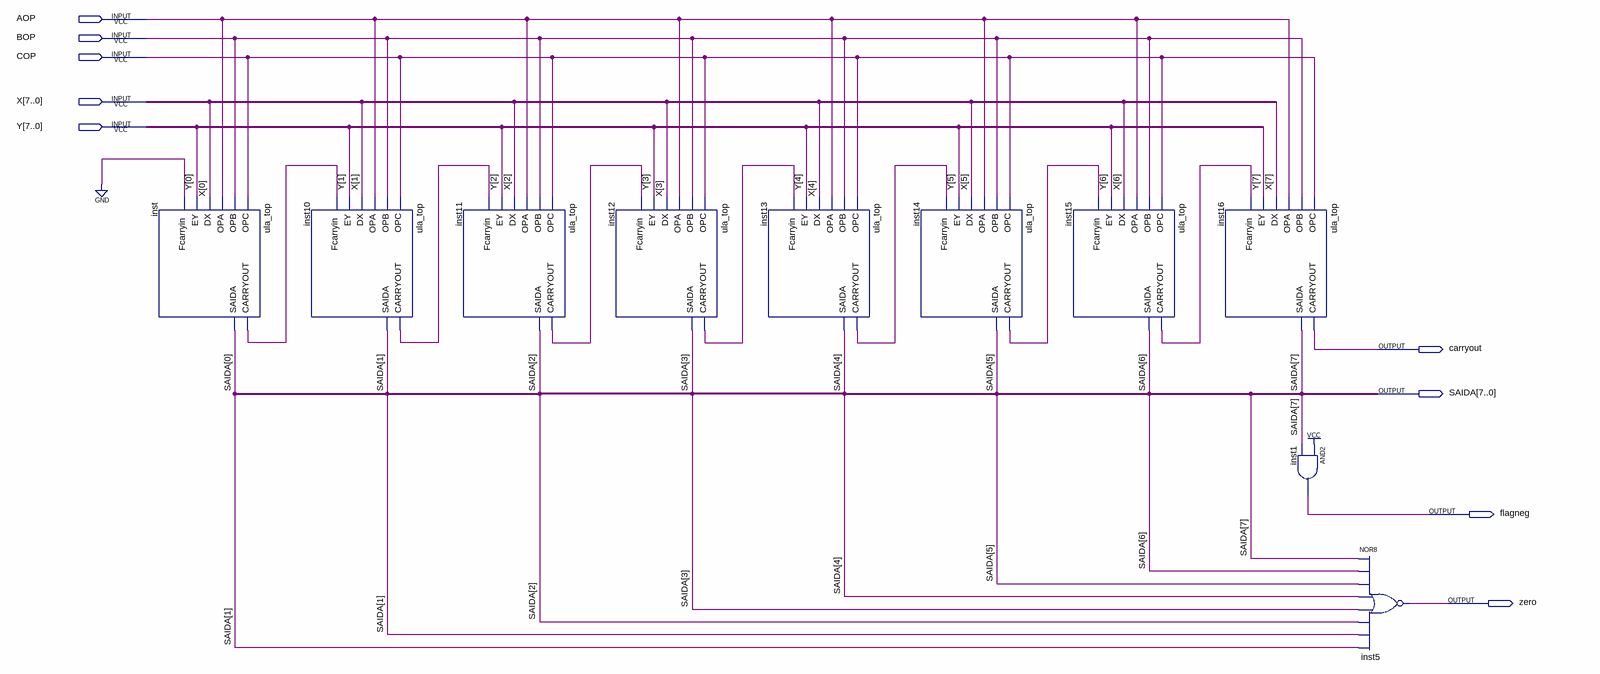
[diagram p0: schematic sheet]
// Quartus schematic ula16.bdf as structural Verilog: 10 symbols, 9 pins
module ula16 (
  input  AOP,
  input  BOP,
  input  COP,
  input  [7:0] X,
  input  [7:0] Y,
  output carryout,
  output [7:0] SAIDA,
  output flagneg,
  output zero
);

  wire inst10_carryout, inst11_carryout, inst12_carryout, inst13_carryout, inst14_carryout, inst15_carryout,
       inst_carryout;

  ula_top inst (
    .OPC(COP), .OPB(BOP), .OPA(AOP), .DX(X[0]), .EY(Y[0]), .Fcarryin(1'b0), .CARRYOUT(inst_carryout),
    .SAIDA(SAIDA[0]));
  ula_top inst10 (
    .OPC(COP), .OPB(BOP), .OPA(AOP), .DX(X[1]), .EY(Y[1]), .Fcarryin(inst_carryout),
    .CARRYOUT(inst10_carryout), .SAIDA(SAIDA[1]));
  ula_top inst11 (
    .OPC(COP), .OPB(BOP), .OPA(AOP), .DX(X[2]), .EY(Y[2]), .Fcarryin(inst10_carryout),
    .CARRYOUT(inst11_carryout), .SAIDA(SAIDA[2]));
  ula_top inst12 (
    .OPC(COP), .OPB(BOP), .OPA(AOP), .DX(X[3]), .EY(Y[3]), .Fcarryin(inst11_carryout),
    .CARRYOUT(inst12_carryout), .SAIDA(SAIDA[3]));
  ula_top inst13 (
    .OPC(COP), .OPB(BOP), .OPA(AOP), .DX(X[4]), .EY(Y[4]), .Fcarryin(inst12_carryout),
    .CARRYOUT(inst13_carryout), .SAIDA(SAIDA[4]));
  ula_top inst14 (
    .OPC(COP), .OPB(BOP), .OPA(AOP), .DX(X[5]), .EY(Y[5]), .Fcarryin(inst13_carryout),
    .CARRYOUT(inst14_carryout), .SAIDA(SAIDA[5]));
  ula_top inst15 (
    .OPC(COP), .OPB(BOP), .OPA(AOP), .DX(X[6]), .EY(Y[6]), .Fcarryin(inst14_carryout),
    .CARRYOUT(inst15_carryout), .SAIDA(SAIDA[6]));
  ula_top inst16 (
    .OPC(COP), .OPB(BOP), .OPA(AOP), .DX(X[7]), .EY(Y[7]), .Fcarryin(inst15_carryout), .CARRYOUT(carryout),
    .SAIDA(SAIDA[7]));
  and inst1 (flagneg, 1'b1, SAIDA[7]);
  nor inst5 (zero, SAIDA[7], SAIDA[6], SAIDA[5], SAIDA[4], SAIDA[3], SAIDA[2], SAIDA[1], SAIDA[1]);
endmodule
